# EAGLE design lna_simple (EAGLE 7.1.0)
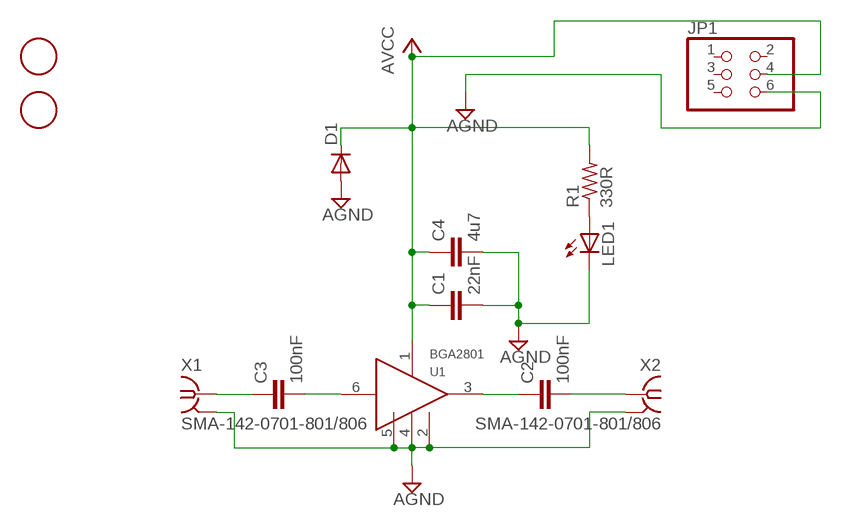
[diagram p0: schematic, sheet 1]

## Parts
C1  22nF  C-EUC0603  [C0603]
C2  100nF  C-EUC0603  [C0603]
C3  100nF  C-EUC0603  [C0603]
C4  4u7  C-EUC0805  [C0805]
D1  DIODE-DO214AC  [DO214AC]
JP1  PINHD-2X3  [2X03]
LED1  LEDCHIP-LED0603  [CHIP-LED0603]
R1  330R  R-US_R0603  [R0603]
U1  BGA2801  [SOTT323-6]
U$1  FIDUCIAL  [FIDUCIAL_1MM]
U$2  FIDUCIAL  [FIDUCIAL_1MM]
X1  SMA-142-0701-801/806  [J502-ND-142-0701-801/806]
X2  SMA-142-0701-801/806  [J502-ND-142-0701-801/806]

## Nets
AGND: C1.2 C4.2 D1.A JP1.6 LED1.C U1.2(GND) U1.4(GND) U1.5(GND) X1.G@1 X1.G@2 X1.G@3 X1.G@4 X2.G@1 X2.G@2 X2.G@3 X2.G@4
AVCC: C1.1 C4.1 D1.C JP1.4 R1.2 U1.1(VCC)
N$1: C3.2 U1.6(IN)
N$2: C2.1 U1.3(OUT)
N$4: C2.2 X2.1
N$6: C3.1 X1.1
N$7: LED1.A R1.1
Unconnected: JP1.1 JP1.2 JP1.3 JP1.5

## Library data of the parts
C1-C4 = rcl:C-EU: CAPACITOR, European symbol
D1 = diode:DIODE-: DIODE
JP1 = pinhead:PINHD-2X3: PIN HEADER
LED1 = adafruit:LED: LED OSRAM: - CHIPLED LG R971, LG N971, LY N971, LG Q971, LY Q971, LO R971, LY R971 LH N974, LH R974 LS Q976, LO Q976, LY Q976 LO Q996 - Hyper CHIPLED LW Q18S LB Q993, LB Q99A, LB R99A - SideLED LS A670, LO A670, LY A670, LG A670, LP A670 LB A673, LV A673, LT A673, LW A673 LH A674 LY A675 LS A676, LA A676, LO A676, LY A676, LW A676 LS A679, LY A679, LG A679 - Hyper Micro SIDELED® LS Y876, LA Y876, LO Y876, LY Y876 LT Y87S - SmartLED LW L88C, LW L88S LB L89C, LB L89S, LG L890 LS L89K, LO L89K, LY L89K LS L896, LA L896, LO L896, LY L896 - TOPLED LS T670, LO T670, LY T670, LG T670, LP T670 LSG T670, LSP T670, LSY T670, LOP T670, LYG T670 LG T671, LOG T671, LSG T671 LB T673, LV T673, LT T673, LW T673 LH T674 LS T676, LA T676, LO T676, LY T676, LB T676, LH T676, LSB T676, LW T676 LB T67C, LV T67C, LT T67C, LS T67K, LO T67K, LY T67K, LW E67C LS E67B, LA E67B, LO E67B, LY E67B, LB E67C, LV E67C, LT E67C LW T67C LS T679, LY T679, LG T679 LS T770, LO T770, LY T770, LG T770, LP T770 LB T773, LV T773, LT T773, LW T773 LH T774 LS E675, LA E675, LY E675, LS T675 LS T776, LA T776, LO T776, LY T776, LB T776 LHGB T686 LT T68C, LB T68C - Hyper Mini TOPLED® LB M676 - Mini TOPLED Santana® LG M470 LS M47K, LO M47K, LY M47K Source: http://www.osram.convergy.de/
R1 = resistor:R-US_: RESISTOR, American symbol
U1 = customs:BGA2801
U$1 U$2 = adafruit:FIDUCIAL: For use by pick and place machines to calibrate the vision/machine, 1mm By microbuilder.eu
X1 X2 = con-coax:SMA-: SMA 50 Ohm End Launch Jack Receptacle - Round Contact Johnson Components Source: www.johnsoncomponents.com .. J502-ND.pdf; MF: JOHNSON COMPONENTS; MPN: 142-0701-801; OC_FARNELL: 1608592; OC_NEWARK: 90F2624

## Board
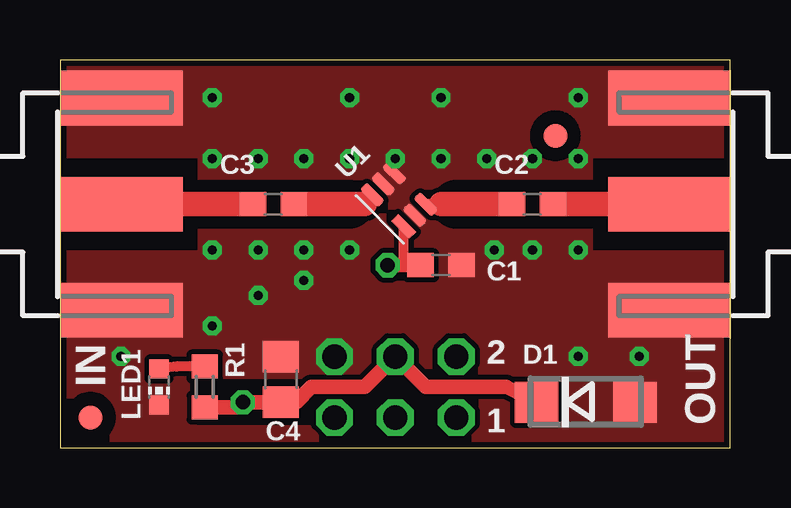
[diagram p1: board, top side]
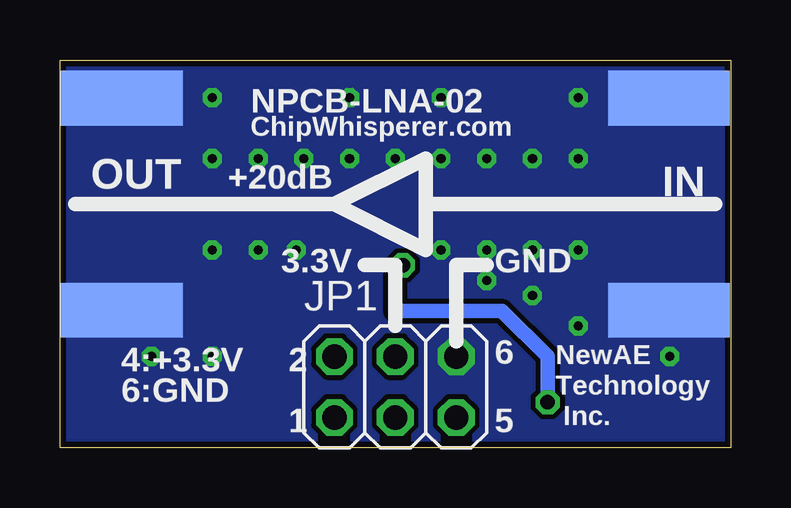
[diagram p2: board, bottom side, seen from below]

Size 27.94 x 16.18 mm. Coordinates in mm from the lower left corner, seen from the top.
Outline: 0,0 27.92,0 27.92,16.18 0,16.18 0,0
Copper layers (1*16): Top 0.035mm / dielectric 1.5mm / Bottom 0.035mm
Design rules "default *": minimum track width 10mil, minimum drill 24mil, track to track 8mil, track to pad 8mil, pad to pad 8mil, via to via 8mil, smd to smd 8mil, copper to edge 10mil, drill to drill 8mil, minimum pad ring 10mil, minimum via ring 8mil, stop-mask expansion 4mil, vias tented up to drill 35mil, thermal gap 10mil
tRestrict: area 5.7,1 to 10.5,2.9; area 0,8.3 to 5.7,12.1; area 22.5,8.3 to 27.9,12.1; area 22.2,8.3 to 23.5,12.1; 2 lines

### Footprints (pad centres in the part's own frame; a part is rotated, then mirrored left to right if it is on the bottom)
C0603 = smd 1.1 x 1: 1 -0.85,0; 2 0.85,0
C0805 = smd 1.3 x 1.5: 1 -0.95,0; 2 0.95,0
DO214AC = smd 1.8 x 1.7: A 2.05,0; C -2.05,0
2X03 = drill 1.016 octagon: 1 -2.54,-1.27; 2 -2.54,1.27; 3 0,-1.27; 4 0,1.27; 5 2.54,-1.27; 6 2.54,1.27
CHIP-LED0603 = smd 0.8 x 0.8: A 0,-0.75; C 0,0.75
R0603 = smd 1 x 1.1: 1 -0.85,0; 2 0.85,0
SOTT323-6 = smd 0.4 x 1.05: 1 -1.3,0; 2 -0.65,0; 3 0,0; 4 0,1.85; 5 -0.65,1.85; 6 -1.3,1.85
FIDUCIAL_1MM = smd 1 x 1: 1 0,0
J502-ND-142-0701-801/806 = smd 5.08 x 2.286: 1 2.565,0; G@1 2.565,4.42; G@2 2.565,-4.42 | smd 5.08 x 2.286 bottom: G@3 2.565,4.42; G@4 2.565,-4.42

### Placement (x,y rotation side)
C1  15.87,7.62 0 top
C2  19.68,10.16 0 top
C3  8.89,10.16 0 top
C4  9.21,2.86 90 top
D1  21.91,1.9 0 top
JP1  13.97,2.54 0 bottom
LED1  4.13,2.54 180 top
R1  6.03,2.54 270 top
U1  15.24,10.16 45 top
U$1  1.27,1.27 0 top
U$2  20.64,13.02 0 top
X1  0,10.16 0 top
X2  27.94,10.16 180 top

### Tracks (layer width: path | path; a pad name or v marks a point on that pad's centre or on a via)
AGND  (via drill 0.38)
  Top 0.406: 2.56,5.08 X1.G@2
  other vias: 6.35,12.06 8.26,12.06 10.16,12.06 12.06,12.06 15.87,12.06 17.78,12.06 19.68,12.06 21.59,12.06 21.59,8.25 19.68,8.25 10.16,8.25 8.26,8.25 6.35,8.25 6.35,5.08 6.35,14.6 12.06,14.6 15.87,14.6 21.59,14.6 21.59,3.81 24.13,3.81 2.54,3.81 13.97,12.06 12.06,8.25 18.1,8.25 10.16,6.98 8.26,6.35
  pour Top (no thermals): 0,16.51 27.94,16.51 27.94,0 0,0
  pour Bottom (no thermals): 0,16.51 27.94,16.51 27.94,0 0,0
AVCC  (via drill 0.6)
  Top 0.406: C1.1 14.32,7.62 U1.1
  Top 0.61: D1.C 18.59,2.54 15.24,2.54 JP1.4 12.7,2.54 10.48,2.54 9.84,1.9 C4.1 | C4.1 | C4.1 v7.62,1.9 7.4,1.69 R1.2 | v13.65,7.62 C1.1
  Bottom 0.61: v7.62,1.9 7.62,3.81 9.53,5.71 13.97,5.71 13.97,7.3 v13.65,7.62
N$1
  Top 0.406: U1.6 12.7,10.55 12.7,10.16
  Top 1.016: C3.2 12.7,10.16
N$2
  Top 0.406: 16.51,10.16 U1.3
  Top 1.016: C2.1 16.51,10.16 15.87,10.16
N$4
  Top 1.016: C2.2 X2.1
N$6
  Top 1.016: X1.1 C3.1
N$7
  Top 0.406: R1.1 4.86,3.39 LED1.A

### Text on the board
tPlace: 2 | IN | 1 | OUT
bPlace: ChipWhisperer.com | NPCB-LNA-02 | IN | +20dB | OUT | GND | 3.3V | NewAE | 6 | 2 | 4:+3.3V | Technology | 6:GND | Inc. | 5 | 1